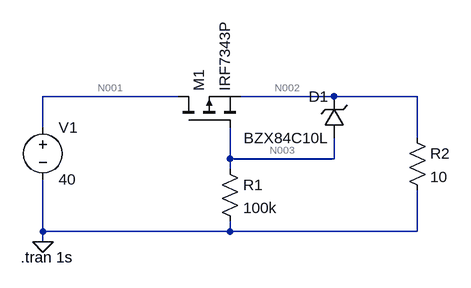
[diagram p0: schematic protectionV1.asc]
protectionV1.asc, the LTspice schematic file:
Version 4
SHEET 1 880 680
WIRE 208 96 0 96
WIRE 448 96 304 96
WIRE 576 96 448 96
WIRE 0 144 0 96
WIRE 576 160 576 96
WIRE 288 192 288 144
WIRE 448 192 448 160
WIRE 448 192 288 192
WIRE 288 208 288 192
WIRE 0 304 0 224
WIRE 288 304 288 288
WIRE 288 304 0 304
WIRE 576 304 576 240
WIRE 576 304 288 304
WIRE 0 320 0 304
FLAG 0 320 0
SYMBOL voltage 0 128 R0
WINDOW 123 0 0 Left 0
WINDOW 39 0 0 Left 0
SYMATTR InstName V1
SYMATTR Value 40
SYMBOL pmos 208 144 R270
SYMATTR InstName M1
SYMATTR Value IRF7343P
SYMBOL zener 464 160 R180
WINDOW 0 24 64 Left 2
WINDOW 3 24 0 Left 2
SYMATTR InstName D1
SYMATTR Value BZX84C10L
SYMBOL res 272 192 R0
SYMATTR InstName R1
SYMATTR Value 100k
SYMBOL res 560 144 R0
SYMATTR InstName R2
SYMATTR Value 10
TEXT -34 344 Left 2 !.tran 1s

The netlist it stands for:
* protectionV1.asc
V1 N001 0 40
M1 N001 N003 N002 N002 IRF7343P
D1 N003 N002 BZX84C10L
R1 N003 0 100k
R2 N002 0 10
.model D D
.lib standard.dio
.model NMOS NMOS
.model PMOS PMOS
.lib standard.mos
.tran 1s
.backanno
.end

* Results of the author's LTspice run, read from the files saved beside the schematic
* Operating Point, zero values left out:
*   V(n001) = 40 V
*   V(n003) = 29.54 V
*   V(n002) = 39.38 V
*   Id(M1) = 3.939 A
*   Is(M1) = -3.939 A
*   I(D1) = -295.4 µA
*   I(R2) = 3.938 A
*   I(R1) = 295.4 µA
*   I(V1) = -3.939 A